# Altium schematic sheet RIAA.SchDoc
size A3
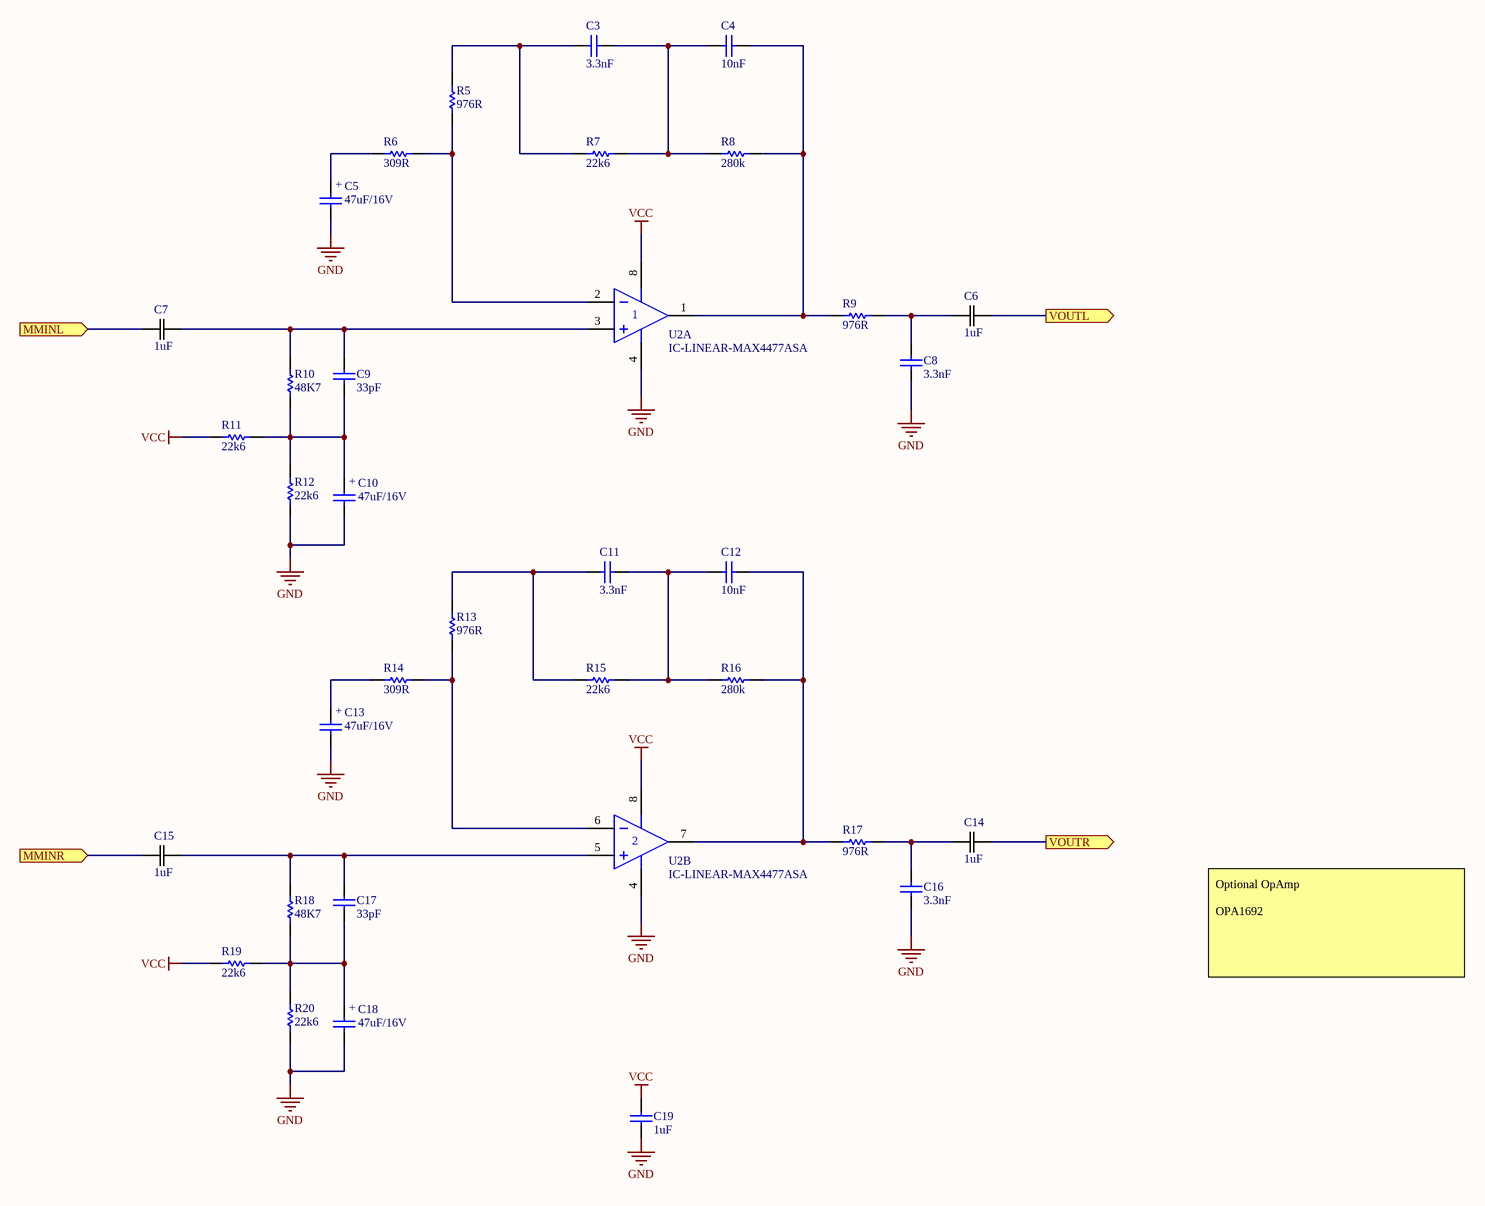
[diagram p0: RIAA.SchDoc]

## Parts
C3  value 3.3nF  [CAPC0805(2012)100_N]  (hidden comment: CAP 3.3nF 16V 0805(2012))
C4  value 10nF  [CAPC0805(2012)145_N]  (hidden comment: CAP 10nF 16V 0805(2012))
C5  47uF/16V  [CAPP_5x5.4]
C6  1uF  [CAP_ECPU_G2]
C7  1uF  [CAP_ECPU_G2]
C8  value 3.3nF  [CAPC0805(2012)100_N]  (hidden comment: CAP 3.3nF 16V 0805(2012))
C9  value 33pF  [CAPC0805(2012)100_N]  (hidden comment: CAP 33pF 16V 0805(2012))
C10  47uF/16V  [CAPP_5x5.4]
C11  value 3.3nF  [CAPC0805(2012)100_N]  (hidden comment: CAP 3.3nF 16V 0805(2012))
C12  value 10nF  [CAPC0805(2012)145_N]  (hidden comment: CAP 10nF 16V 0805(2012))
C13  47uF/16V  [CAPP_5x5.4]
C14  1uF  [CAP_ECPU_G2]
C15  1uF  [CAP_ECPU_G2]
C16  value 3.3nF  [CAPC0805(2012)100_N]  (hidden comment: CAP 3.3nF 16V 0805(2012))
C17  value 33pF  [CAPC0805(2012)100_N]  (hidden comment: CAP 33pF 16V 0805(2012))
C18  47uF/16V  [CAPP_5x5.4]
C19  value 1uF  [CAPC0805(2012)145_N]  (hidden comment: CAP 1uF 16V 0805(2012))
R5  value 976R  [RESC0805(2012)_N]  (hidden comment: 976R 1% 0805(2012))
R6  value 309R  [RESC0805(2012)_N]  (hidden comment: 309R 1% 0805(2012))
R7  value 22k6  [RESC0805(2012)_N]  (hidden comment: 22K6 1% 0805(2012))
R8  value 280k  [RESC0805(2012)_N]  (hidden comment: 280K 1% 0805(2012))
R9  value 976R  [RESC0805(2012)_N]  (hidden comment: 976R 1% 0805(2012))
R10  value 48K7  [RESC0805(2012)_N]  (hidden comment: 48K7 1% 0805(2012))
R11  value 22k6  [RESC0805(2012)_N]  (hidden comment: 22K6 1% 0805(2012))
R12  value 22k6  [RESC0805(2012)_N]  (hidden comment: 22K6 1% 0805(2012))
R13  value 976R  [RESC0805(2012)_N]  (hidden comment: 976R 1% 0805(2012))
R14  value 309R  [RESC0805(2012)_N]  (hidden comment: 309R 1% 0805(2012))
R15  value 22k6  [RESC0805(2012)_N]  (hidden comment: 22K6 1% 0805(2012))
R16  value 280k  [RESC0805(2012)_N]  (hidden comment: 280K 1% 0805(2012))
R17  value 976R  [RESC0805(2012)_N]  (hidden comment: 976R 1% 0805(2012))
R18  value 48K7  [RESC0805(2012)_N]  (hidden comment: 48K7 1% 0805(2012))
R19  value 22k6  [RESC0805(2012)_N]  (hidden comment: 22K6 1% 0805(2012))
R20  value 22k6  [RESC0805(2012)_N]  (hidden comment: 22K6 1% 0805(2012))
U2  IC-LINEAR-MAX4477ASA  [SOIC8_N]  (parts A,B of 2)

## Ports
MMINL (in), MMINR (in), VOUTL (out), VOUTR (out)

## Nets
GND: C5.2 C8.1 C10.2 C13.2 C16.1 C18.2 C19.1 R12.1 R20.1 U2.4(V-)
VCC: C19.2 R11.1 R19.1 U2.8(V+)
MMINL: C7.1 ; port MMINL
MMINR: C15.1 ; port MMINR
VOUTL: C6.2 ; port VOUTL
VOUTR: C14.2 ; port VOUTR
NetC3_1: C3.1 C4.1 R7.2 R8.1
NetC3_2: C3.2 R5.2 R7.1
NetC4_2: C4.2 R8.2 R9.2 U2.1(OUT1)
NetC5_1: C5.1 R6.1
NetC6_1: C6.1 C8.2 R9.1
NetC7_2: C7.2 C9.2 R10.1 U2.3(IN1+)
NetC9_1: C9.1 C10.1 R10.2 R11.2 R12.2
NetC11_1: C11.1 C12.1 R15.2 R16.1
NetC11_2: C11.2 R13.2 R15.1
NetC12_2: C12.2 R16.2 R17.2 U2.7(OUT2)
NetC13_1: C13.1 R14.1
NetC14_1: C14.1 C16.2 R17.1
NetC15_2: C15.2 C17.2 R18.1 U2.5(IN2+)
NetC17_1: C17.1 C18.1 R18.2 R19.2 R20.2
NetR5_1: R5.1 R6.2 U2.2(IN1-)
NetR13_1: R13.1 R14.2 U2.6(IN2-)

## Notes on the sheet
- Optional OpAmp
  OPA1692
- (in symbol CAPP_47UF16V_EEE-1CA470WR) +

## Library data of the parts
C3 C8 C11 C16 = CMP-1036-03397-1: CAP 3.3nF 16V ±1% 0805 (2012 Metric) Thickness 1mm SMD; Tolerance: Â±1%; Case-EIA: 0805; Case-Metric: 2012; Max Thickness: 1 mm; Rated Voltage: 16 V; Technology: SMT
C4 C12 = CMP-1036-03817-1: CAP 10nF 16V ±5% 0805 (2012 Metric) Thickness 1.45mm SMD; Case-EIA: 0805; Case-Metric: 2012; Tolerance: Â±5%; Technology: SMT; Rated Voltage: 16 V; Max Thickness: 1.45 mm
C5 C10 C13 C18 = CAPP_47UF16V_EEE-1CA470WR: 47µF 16V Aluminum Electrolytic Capacitors Radial, Can - SMD 1000 Hrs @ 85°C; Value: 47uF/16V; Farnell: 2753042; DigiKey: PCE3890TR-ND; MPN: EEE-1CA470WR
C6 C7 C14 C15 = CAP-ECP-U1C105MA5: 1µF Film Capacitor  16V Acrylic, Metallized - Stacked 1210 (3225 Metric); Vendor: Panasonic; Built_By: EMA_UL_Team; Type: DEV; C: Copyright (C) 2015 Accelerated Designs. All rights reserved; MPN: ECP-U1C105MA5; RefDes: RefDes; Value: 1uF
C9 C17 = CMP-1036-01404-1: CAP 33pF 16V ±1% 0805 (2012 Metric) Thickness 1mm SMD; Case-Metric: 2012; Case-EIA: 0805; Tolerance: Â±1%; Max Thickness: 1 mm; Technology: SMT; Rated Voltage: 16 V
C19 = CMP-1036-04748-1: CAP 1uF 16V ±20% 0805 (2012 Metric) Thickness 1.45mm SMD; Tolerance: Â±20%; Case-Metric: 2012; Case-EIA: 0805; Technology: SMT; Rated Voltage: 16 V; Max Thickness: 1.45 mm
R5 R9 R13 R17 = CMP-1013-00509-1: 976R 0.125W 1% 0805 (2012 Metric)  SMD; Case-EIA: 0805; Case-Metric: 2012; Power: 0.125 W; Technology: SMT; Tolerance: 1 %
R6 R14 = CMP-1013-00451-1: 309R 0.125W 1% 0805 (2012 Metric)  SMD; Case-EIA: 0805; Case-Metric: 2012; Technology: SMT; Tolerance: 1 %; Power: 0.125 W
R7 R11 R12 R15 R19 R20 = CMP-1013-00661-1: 22K6 0.125W 1% 0805 (2012 Metric)  SMD; Case-Metric: 2012; Case-EIA: 0805; Tolerance: 1 %; Technology: SMT; Power: 0.125 W
R8 R16 = CMP-1013-00785-1: 280K 0.125W 1% 0805 (2012 Metric)  SMD; Case-EIA: 0805; Case-Metric: 2012; Tolerance: 1 %; Power: 0.125 W; Technology: SMT
R10 R18 = CMP-1013-00701-1: 48K7 0.125W 1% 0805 (2012 Metric)  SMD; Case-Metric: 2012; Case-EIA: 0805; Tolerance: 1 %; Power: 0.125 W; Technology: SMT
U2 = IC-LINEAR-MAX4477ASA: Dual Rail-to-Rail output  Low-Power Operational Amplifier; MPN: MAX4477ASA+; Farnell: 1550527